# Altium schematic sheet MT_AO.SchDoc: Electrontainer AUSGANG MODUL
size A4; Engineer: PPavlov; Revision: 1.0; SheetNumber: 5; SheetTotal: 5
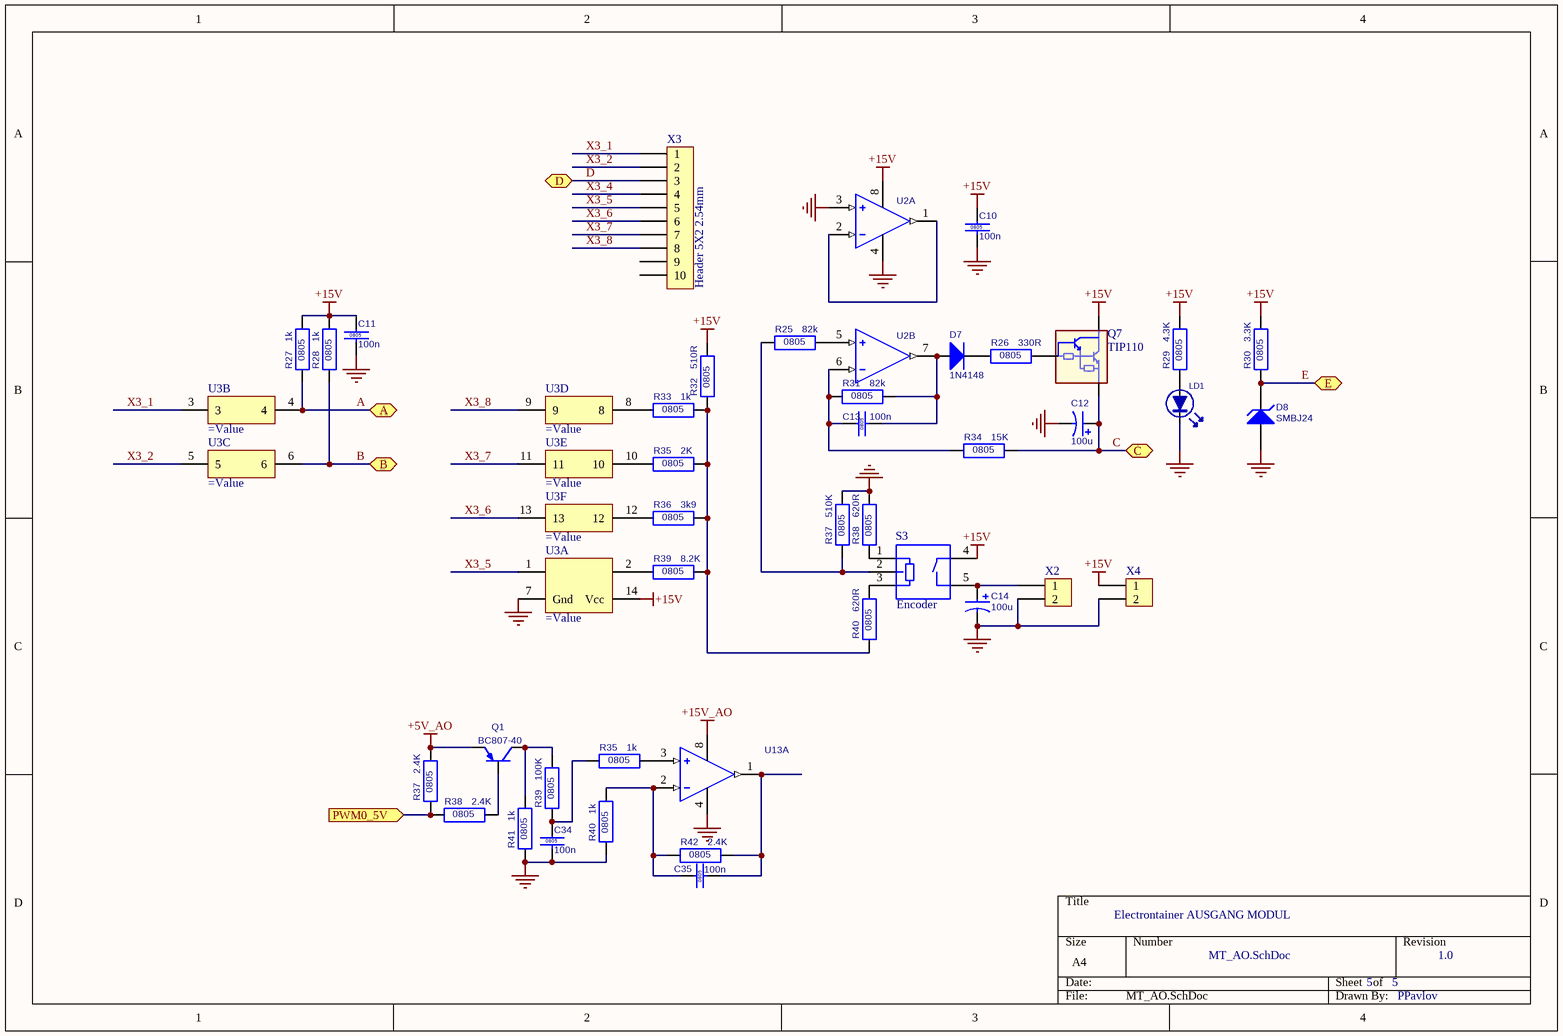
[diagram p0: MT_AO.SchDoc]

## Parts
(Parts that share a designator on the sheet are numbered #1, #2 ... from top to bottom, then left to right.)
C10  Case: 0805  [RC0805]  (hidden comment: 100n)
C11  Case: 0805  [RC0805]  (hidden comment: 100n)
C12  100u  [CEH12.5D10P5.0]
C13  Case: 0805  [RC0805]  (hidden comment: 100n)
C14  100u  [CEH12.5D10P5.0]
C34  Case: 0805  [RC0805]  (hidden comment: 100n)
C35  Case: 0805  [RC0805]  (hidden comment: 100n)
D7  Part number: 1N4148  [DO-35]  (hidden comment: Diode)
D8  Part Number: SMBJ24  [SMB]  (hidden comment: Zenner_diode)
LD1  *  [RC805-35X60 - polar]  (value not drawn)
Q1  Part number: BC807-40  [SOT23-3]  (hidden comment: PNP_transistor_SOT23-3)
Q7  TIP110  [TO-220AB_V]
R25  Case: 0805  [RC0805]  (hidden comment: 82k)
R26  Case: 0805  [RC0805]  (hidden comment: 330R)
R27  Case: 0805  [RC0805]  (hidden comment: 1k)
R28  Case: 0805  [RC0805]  (hidden comment: 1k)
R29  Case: 0805  [RC0805]  (hidden comment: 4.3K)
R30  Case: 0805  [RC0805]  (hidden comment: 3.3K)
R31  Case: 0805  [RC0805]  (hidden comment: 82k)
R32  Case: 0805  [RC0805]  (hidden comment: 510R)
R33  Case: 0805  [RC0805]  (hidden comment: 1k)
R34  Case: 0805  [RC0805]  (hidden comment: 15K)
R35#1  Case: 0805  [RC0805]  (hidden comment: 2K)
R35#2  Case: 0805  [RC0805]  (hidden comment: 1k)
R36  Case: 0805  [RC0805]  (hidden comment: 3k9)
R37#1  Case: 0805  [RC0805]  (hidden comment: 510K)
R37#2  Case: 0805  [RC0805]  (hidden comment: 2.4K)
R38#1  Case: 0805  [RC0805]  (hidden comment: 620R)
R38#2  Case: 0805  [RC0805]  (hidden comment: 2.4K)
R39#1  Case: 0805  [RC0805]  (hidden comment: 8.2K)
R39#2  Case: 0805  [RC0805]  (hidden comment: 100K)
R40#1  Case: 0805  [RC0805]  (hidden comment: 620R)
R40#2  Case: 0805  [RC0805]  (hidden comment: 1k)
R41  Case: 0805  [RC0805]  (hidden comment: 1k)
R42  Case: 0805  [RC0805]  (hidden comment: 2.4K)
S3  Encoder  [VRS_01]
U2  LM2904D  [SO-8]  (value not drawn)  (parts A,B of 2)
U3  (no value)  [SO-14]  (parts A,B,C,D,E,F of 6)
U13  LM2904D  [SO-8]  (value not drawn)  (part A of 2)
X2  (no value)  [PWL-2]
X3  Header 5X2 2.54mm  [Pins2x5_2.54mm]
X4  (no value)  [PWL-2]

## Ports
A, B, C, D, E, PWM0_5V (in)

## Nets
+5V_AO: Q1.2(E) R37#2.2
+15V: C10.1 C11.1 Q7.3(K) R27.2 R28.2 R29.2 R30.2 R32.2 S3.4 U2.8(Vcc+) U3.14(Vcc) X4.1
+15V_AO: U13.8(Vcc+)
DGND: C10.2 C11.2 C12.2 C14.2 C34.2 D8.2(A) LD1.2 R37#1.2 R38#1.2 R40#2.1 R41.1 U2.3(IN1+) U2.4(Vcc-) U3.7(Gnd) U13.4(Vcc-) X2.2 X4.2
A: R27.1 U3.4 ; port A
B: R28.1 U3.6 ; port B
C: C12.1 Q7.2(E) R34.2 ; port C
D: X3.3 ; port D
E: D8.1(K) R30.1 ; port E
PWM0_5V: R37#2.1 R38#2.1 ; port PWM0_5V
X3_1: U3.3 X3.1
X3_2: U3.5 X3.2
X3_4: X3.4
X3_5: U3.1 X3.5
X3_6: U3.13 X3.6
X3_7: U3.11 X3.7
X3_8: U3.9 X3.8
NetC13_1: C13.1 R31.1 R34.1 U2.6(IN2-)
NetC13_2: C13.2 D7.2(A) R31.2 U2.7(OUT2)
NetC14_1: C14.1 S3.5 X2.1
NetC34_1: C34.1 R35#2.1 R39#2.1
NetC35_1: C35.1 R40#2.2 R42.1 U13.2(IN1-)
NetC35_2: C35.2 R42.2 U13.1(OUT1)
NetD7_1: D7.1(K) R26.1
NetLD1_1: LD1.1 R29.1
NetQ1_1: Q1.1(B) R38#2.2
NetQ1_3: Q1.3(C) R39#2.2 R41.2
NetQ7_1: Q7.1(B) R26.2
NetR25_1: R25.1 R37#1.1 S3.2
NetR25_2: R25.2 U2.5(IN2+)
NetR32_1: R32.1 R33.2 R35#1.2 R36.2 R39#1.2 R40#1.1
NetR33_1: R33.1 U3.8
NetR35#1_1: R35#1.1 U3.10
NetR35#2_2: R35#2.2 U13.3(IN1+)
NetR36_1: R36.1 U3.12
NetR38#1_1: R38#1.1 S3.1
NetR39#1_1: R39#1.1 U3.2
NetR40#1_2: R40#1.2 S3.3
NetU2_1: U2.1(OUT1) U2.2(IN1-)

Not connected (* = marked no-connect by the designer): X3 9 10

## Library data of the parts
C10 C11 C13 C34 C35 = CC0805K-X5R-50V0-100N: Chip capacitor, 20p; Manufacturer: KEMET, YAGEO; Voltage: 50V; Tolerance: 10%; ROSH: Yes; Material: X5R; Package: 7" paper reel; Part number: CC0805K-X5R-50V0-100N; Suppliers: Avnet; Temperature: -55 - +125 C; Value: 100n; Supplier: Avnet-Abacus; Pb Free: Yes; Component Type: Standard; ComponentLink1Description: Manufacturer Link; ComponentLink2Description: Datasheet; ComponentLink2URL: http://www.yageo.com/pdf/UPY-GPHC_X5R_6.3V-to-50V_3.pdf; Published: 05.04.2010; Publisher: ppavlov
  C10 C11 C13: Stock ID: C045
C12 C14 = CEH12.5D10P5.0M-50V-100U: Electrolytic capacitor; Manufacturer: Panasonic; Manufacturer Part Number: EEUFC1H101; Voltage: 50V; Tolerance: 20%; Pb Free: Yes; Case: 12.5x10x5.0; Value: 100u; Part Number: CEH12.5D10P5.0M-50V-100U; Temperature: -55 - +105 C; Supplier: Megasan; MOQ: 500; Component Type: Standard; ComponentLink1Description: Manufacturer Link; ComponentLink2Description: Datasheet; ComponentLink2URL: http://industrial.panasonic.com/www-data/pdf/ABA0000/ABA0000CE22.pdf; Published: 11.12.2009; Publisher: ppavlov
D7 = 1N4148: Switching diode; Current: 150ma; Voltage: 75V; Pb Free: Yes; Temperature: -60 - +175 C; Manufacturer Part Number: 1N4148; Component Type: Standard; ComponentLink1Description: Manufacturer Link; Case: DO-35; ComponentLink2Description: Datasheet; Published: 20.05.2012; Publisher: ppavlov
D8 = SMBJ24: Transient Voltage Suppressor; Manufacturer: Fairchild; Manufacturer Part Number: SMBJ24, SMBJ24A; Current: 15.4A; Voltage: 24V; Pb Free: Yes; Stock ID: D008a; Temperature: -55 - +150 C; Supplier: EBV; Component Type: Standard; ComponentLink1Description: Manufacturer Link; Case: SMB; ComponentLink2Description: Datasheet; ComponentLink2URL: http://www.datasheetcatalog.org/datasheet/mcc/SMBJ24C.pdf; Published: 16.11.2009; Publisher: tkondratyuk
LD1 = LED_RED_SMD0805: Surface mount red led; Type: DIode; Current: 20ma; Pb Free: Yes; Value: *; ID: LED_SMD0805; Part Number: LED_RED_SMD0805; Temperature: -65 - +125 C; Supplier: EBV; Component Type: Standard; ComponentLink1Description: Manufacturer Link; Case: SMA; ComponentLink2Description: Datasheet; Published: 22.12.2009; Publisher: ppavlov
Q1 = BC807-40: General Purpose  PNP Transistor; Manufacturer: ONS, NXP; Manufacturer Part Number: BC807?40LT1G; Analogs: MMBT2907A; Current: 0.5A; Voltage CEO: -45V; Pb Free: Yes; Stock ID: Q010; Temperature: -55 - +150 C; Supplier: EBV; MOQ: 3000; Package: Tape and Reel; Component Type: Standard; ComponentLink1Description: Manufacturer Link; Case: SOT23-3; ComponentLink2Description: Datasheet; ComponentLink2URL: http://www.onsemi.com/pub/Collateral/BC807-16LT1-D.PDF; Published: 16.11.2009; Publisher: tkondratyuk
Q7 = TIP110: Darlington transistor; Manufacturer: ST; Current: 2A; Voltage CEO: 60V; Pb Free: Yes; Part Number: TIP110; Temperature: -50 - +150 C; Manufacturer Part Number: TIP110; Component Type: Standard; ComponentLink1Description: Manufacturer Link; Case: TO220; ComponentLink2Description: Datasheet; Published: 20.05.2012; Publisher: ppavlov
R25 R31 = RC0805F-82K0: Chip resistor; Manufacturer: PHILIPS, SAMSUNG; Voltage: 200V; Power: 1/10W; Tolerance: 1%; Pb Free: Yes; Value: 82k; Part Number: RC0805F-82K0; Temperature: -55 - +155 C; Supplier: Megasan; Component Type: Standard; ComponentLink1Description: Manufacturer Link; ComponentLink2Description: Datasheet; ComponentLink2URL: http://www.yageo.com/pdf/PYu-RC1206_51_RoHS_L_4.pdf; Published: 11.12.2009; Publisher: ppavlov
R26 = RC0805F-330R: Chip resistor; Manufacturer: PHILIPS, SAMSUNG; Voltage: 200V; Power: 1/10W; Tolerance: 1%; Pb Free: Yes; Value: 330R; Part Number: RC0805F-330R; Temperature: -55 - +155 C; Supplier: Megasan; Component Type: Standard; ComponentLink1Description: Manufacturer Link; ComponentLink2Description: Datasheet; ComponentLink2URL: http://www.yageo.com/pdf/PYu-RC1206_51_RoHS_L_4.pdf; Published: 11.12.2009; Publisher: ppavlov
R27 R28 R33 R35#2 R40#2 R41 = RC0805F-1K00: Chip resistor; Manufacturer: PHILIPS, SAMSUNG; Voltage: 200V; Power: 1/10W; Tolerance: 1%; Pb Free: Yes; Value: 1k; Part Number: RC0805F-1K00; Temperature: -55 - +155 C; Supplier: Megasan; Component Type: Standard; ComponentLink1Description: Manufacturer Link; ComponentLink2Description: Datasheet; ComponentLink2URL: http://www.yageo.com/pdf/PYu-RC1206_51_RoHS_L_4.pdf; Published: 11.12.2009; Publisher: ppavlov
R29 = RC0805F-4K30: Chip resistor; Manufacturer: PHILIPS, SAMSUNG; Voltage: 200V; Power: 1/10W; Tolerance: 1%; Pb Free: Yes; Value: 4.3K; Part Number: RC0805F-4K30; Temperature: -55 - +155 C; Supplier: Megasan; Component Type: Standard; ComponentLink1Description: Manufacturer Link; ComponentLink2Description: Datasheet; ComponentLink2URL: http://www.yageo.com/pdf/PYu-RC1206_51_RoHS_L_4.pdf; Published: 11.12.2009; Publisher: ppavlov
R30 = RC0805F-3K30: Chip resistor; Manufacturer: PHILIPS, SAMSUNG; Voltage: 200V; Power: 1/10W; Tolerance: 1%; Pb Free: Yes; Value: 3.3K; Part Number: RC0805F-3K30; Temperature: -55 - +155 C; Supplier: Megasan; Component Type: Standard; ComponentLink1Description: Manufacturer Link; ComponentLink2Description: Datasheet; ComponentLink2URL: http://www.yageo.com/pdf/PYu-RC1206_51_RoHS_L_4.pdf; Published: 11.12.2009; Publisher: ppavlov
R32 = RC0805F-510R: Chip resistor; Manufacturer: PHILIPS, SAMSUNG; Voltage: 200V; Power: 1/10W; Tolerance: 1%; Pb Free: Yes; Value: 510R; Part Number: RC0805F-510R; Temperature: -55 - +155 C; Supplier: Megasan; Component Type: Standard; ComponentLink1Description: Manufacturer Link; ComponentLink2Description: Datasheet; ComponentLink2URL: http://www.yageo.com/pdf/PYu-RC1206_51_RoHS_L_4.pdf; Published: 11.12.2009; Publisher: ppavlov
R34 = RC0805F-15K0: Chip resistor; Manufacturer: PHILIPS, SAMSUNG; Voltage: 200V; Power: 1/10W; Tolerance: 1%; Pb Free: Yes; Value: 15K; Part Number: RC0805F-15K0; Temperature: -55 - +155 C; Supplier: Megasan; Component Type: Standard; ComponentLink1Description: Manufacturer Link; ComponentLink2Description: Datasheet; ComponentLink2URL: http://www.yageo.com/pdf/PYu-RC1206_51_RoHS_L_4.pdf; Published: 11.12.2009; Publisher: ppavlov
R35#1 = RC0805F-2K00: Chip resistor; Manufacturer: PHILIPS, SAMSUNG; Voltage: 200V; Power: 1/10W; Tolerance: 1%; Pb Free: Yes; Value: 2K; Part Number: RC0805F-2K00; Temperature: -55 - +155 C; Supplier: Megasan; Component Type: Standard; ComponentLink1Description: Manufacturer Link; ComponentLink2Description: Datasheet; ComponentLink2URL: http://www.yageo.com/pdf/PYu-RC1206_51_RoHS_L_4.pdf; Published: 11.12.2009; Publisher: ppavlov
R36 = RC0805F-3K90: Chip resistor; Manufacturer: PHILIPS, SAMSUNG; Voltage: 200V; Power: 1/10W; Tolerance: 1%; Pb Free: Yes; Value: 3k9; Part Number: RC0805F-3K90; Temperature: -55 - +155 C; Supplier: Megasan; Component Type: Standard; ComponentLink1Description: Manufacturer Link; ComponentLink2Description: Datasheet; ComponentLink2URL: http://www.yageo.com/pdf/PYu-RC1206_51_RoHS_L_4.pdf; Published: 11.12.2009; Publisher: ppavlov
R37#1 = RC0805F-510K: Chip resistor; Manufacturer: PHILIPS, SAMSUNG; Voltage: 200V; Power: 1/10W; Tolerance: 1%; Pb Free: Yes; Value: 510K; Part Number: RC0805F-510K; Temperature: -55 - +155 C; Supplier: Megasan; Component Type: Standard; ComponentLink1Description: Manufacturer Link; ComponentLink2Description: Datasheet; ComponentLink2URL: http://www.yageo.com/pdf/PYu-RC1206_51_RoHS_L_4.pdf; Published: 11.12.2009; Publisher: ppavlov
R37#2 R38#2 R42 = RC0805F-2K40: Chip resistor; Manufacturer: PHILIPS, SAMSUNG; Voltage: 200V; Power: 1/10W; Tolerance: 1%; Pb Free: Yes; Value: 2.4K; Part Number: RC0805F-2K40; Temperature: -55 - +155 C; Supplier: Megasan; Component Type: Standard; ComponentLink1Description: Manufacturer Link; ComponentLink2Description: Datasheet; ComponentLink2URL: http://www.yageo.com/pdf/PYu-RC1206_51_RoHS_L_4.pdf; Published: 11.12.2009; Publisher: ppavlov
R38#1 R40#1 = RC0805F-620R: Chip resistor; Manufacturer: PHILIPS, SAMSUNG; Voltage: 200V; Power: 1/10W; Tolerance: 1%; Pb Free: Yes; Value: 620R; Part Number: RC0805F-620R; Temperature: -55 - +155 C; Supplier: Megasan; Component Type: Standard; ComponentLink1Description: Manufacturer Link; ComponentLink2Description: Datasheet; ComponentLink2URL: http://www.yageo.com/pdf/PYu-RC1206_51_RoHS_L_4.pdf; Published: 11.12.2009; Publisher: ppavlov
R39#1 = RC0805F-8K20: Chip resistor; Manufacturer: PHILIPS, SAMSUNG; Voltage: 200V; Power: 1/10W; Tolerance: 1%; Pb Free: Yes; Value: 8.2K; Part Number: RC0805F-8K20; Temperature: -55 - +155 C; Supplier: Megasan; Component Type: Standard; ComponentLink1Description: Manufacturer Link; ComponentLink2Description: Datasheet; ComponentLink2URL: http://www.yageo.com/pdf/PYu-RC1206_51_RoHS_L_4.pdf; Published: 11.12.2009; Publisher: ppavlov
R39#2 = RC0805F-100K: Chip resistor; Manufacturer: PHILIPS, SAMSUNG; Voltage: 200V; Power: 1/10W; Tolerance: 1%; Pb Free: Yes; Value: 100K; Part Number: RC0805F-100K; Temperature: -55 - +155 C; Supplier: Megasan; Component Type: Standard; ComponentLink1Description: Manufacturer Link; ComponentLink2Description: Datasheet; ComponentLink2URL: http://www.yageo.com/pdf/PYu-RC1206_51_RoHS_L_4.pdf; Published: 11.12.2009; Publisher: ppavlov
S3 = VRS_01: Standard; Part Number: VRS_01; Manufacturer Part Number: VRS_01; Package: VRS_01; Component Type: Variable resistor and switch; Case: VRS_01; Published: 20.05.2012; Publisher: ppavlov; ComponentLink2Description: Datasheet
U2 = TL082: GENERAL PURPOSE J-FET / DUAL OPERATIONAL AMPLIFIERS; Part Number: TL082; Manufacturer: ST; Manufacturer Part Number: TL082AI; Pb Free: Yes; Temperature: -40 - +105 C; Component Type: Standard; ComponentLink1Description: Manufacturer Link; Case: SO-8; ComponentLink2Description: Datasheet; Published: 20.05.2012; Publisher: ppavlov
U3 = SN7407D: Hex buffer; Manufacturer: Ti; Pb Free: Yes; Part Number: SN7407D; Temperature: 0 - +70 C; Manufacturer Part Number: SN7407D; Component Type: Standard; ComponentLink1Description: Manufacturer Link; Case: SO-14; ComponentLink2Description: Datasheet; Published: 06.04.2011; Publisher: ppavlov
U13 = LM2904D: Dual opamps; Manufacturer: TI; Pb Free: Yes; Part Number: LM2904D; Temperature: -40 - +125 C; Supplier: EBV; Manufacturer Part Number: LM2904D; Component Type: Standard; ComponentLink1Description: Manufacturer Link; Case: SO-8; ComponentLink2Description: Datasheet; ComponentLink2URL: http://www.ti.com/lit/gpn/lm2904; Published: 13.11.2009; Publisher: tkondratyuk
X2 X4 = PWL-2: PWL-2  3.96mm pitch; Pins number: 2; Pb Free: Yes; Part Number: PWL-2; Temperature: -40 - +105 C; Component Type: Standard; ComponentLink1Description: Manufacturer Link; Case: PWL-2; ComponentLink2Description: Datasheet; Published: 05.01.2010; Publisher: ppavlov
X3 = Header 5X2 2.54mm: Pins number: 8; Pb Free: Yes; Part Number: Header 5X2 2.54mm; Temperature: -40 - +105 C; Component Type: Standard; ComponentLink1Description: Manufacturer Link; Case: Pins2x5_2.54mm; ComponentLink2Description: Datasheet; Published: 05.01.2010; Publisher: ppavlov